# EAGLE design human_interface_arduino (EAGLE 5.11)
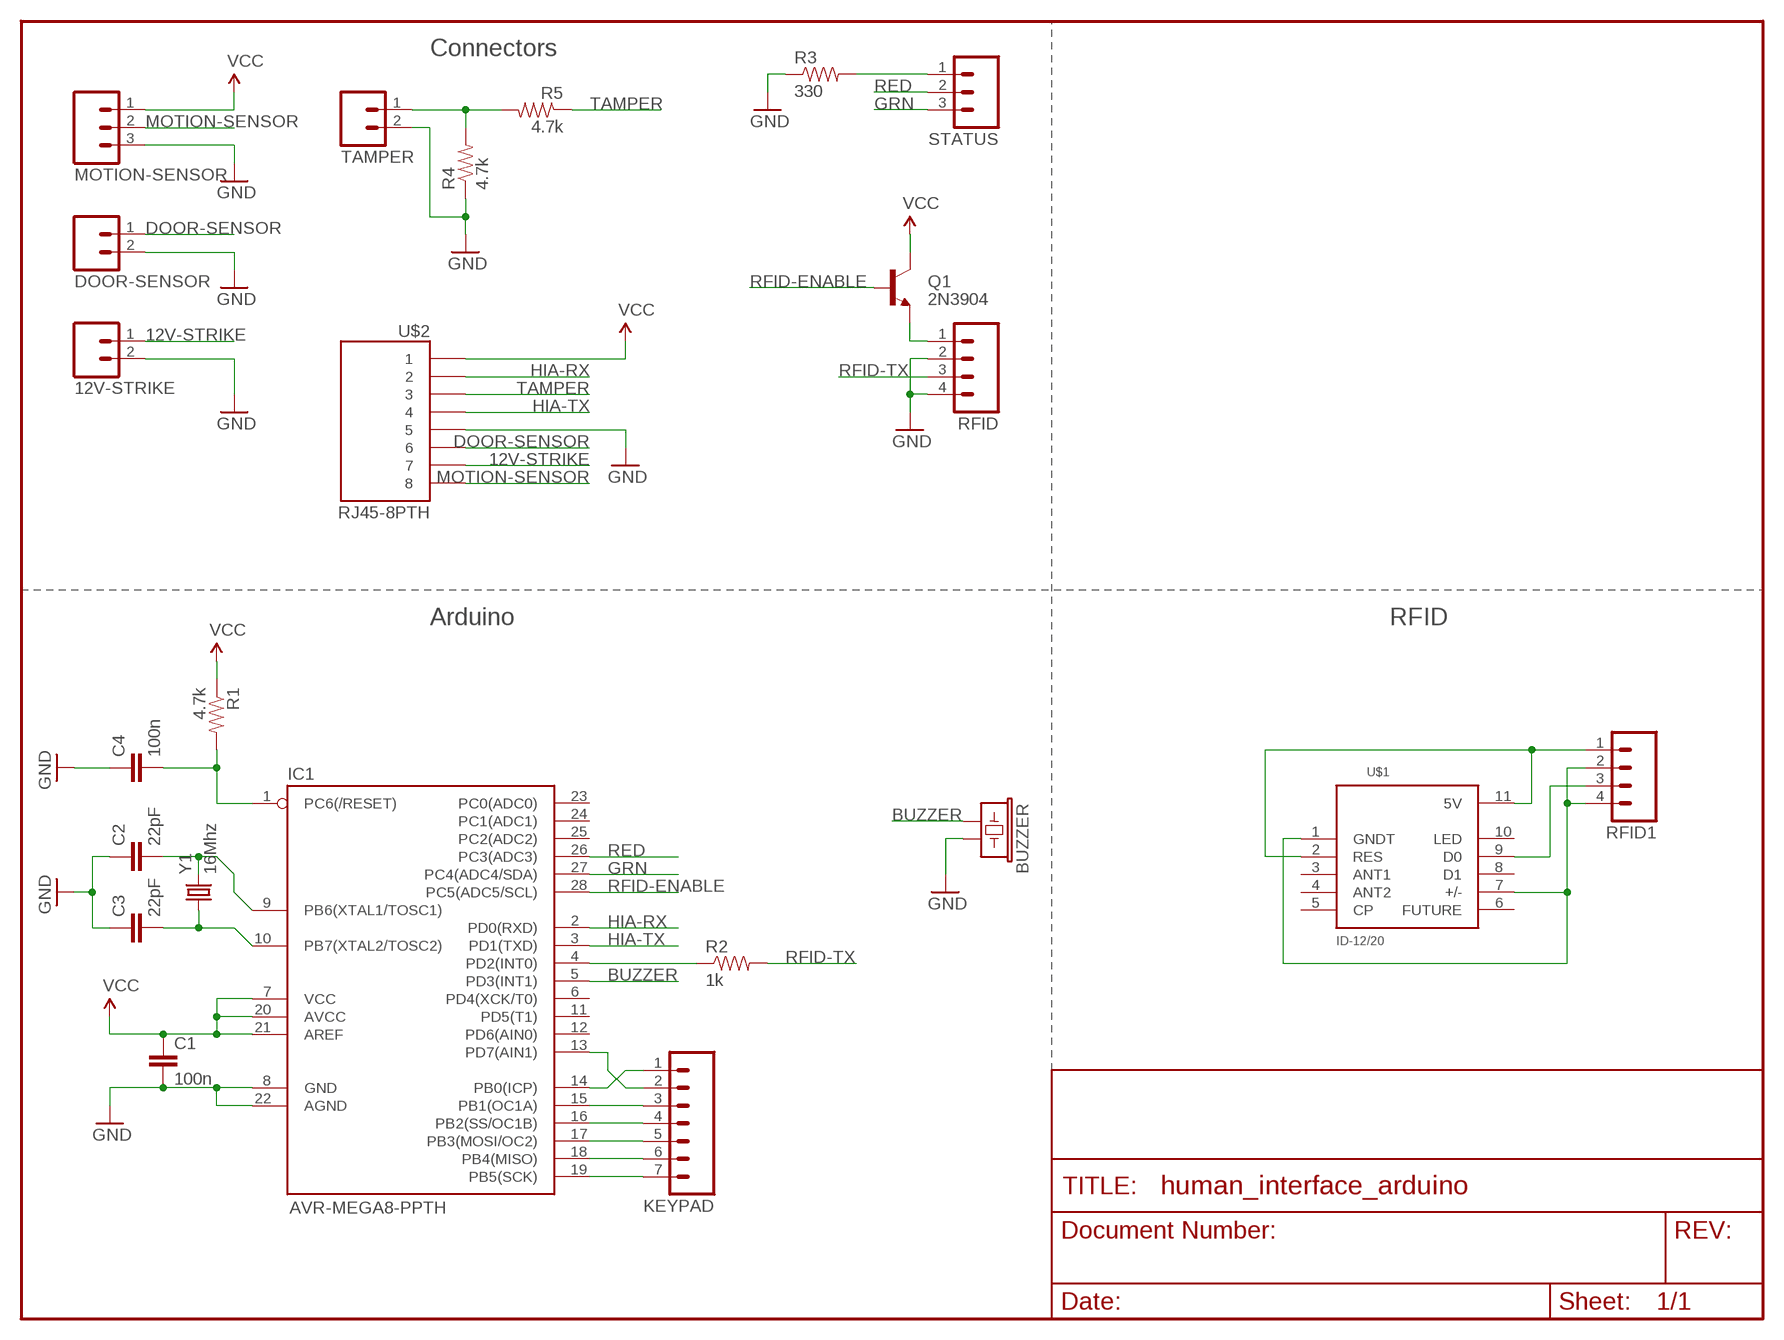
[diagram p0: schematic, sheet 1]

## Parts
12V-STRIKE  M023.5MM  [SCREWTERMINAL-3.5MM-2]
BUZZER  BUZZERPTH  [BUZZER-12MM]
C1  100n  CAPPTH  [CAP-PTH-SMALL]
C2  22pF  CAPPTH  [CAP-PTH-SMALL]
C3  22pF  CAPPTH  [CAP-PTH-SMALL]
C4  100n  CAPPTH  [CAP-PTH-SMALL]
DOOR-SENSOR  M023.5MM  [SCREWTERMINAL-3.5MM-2]
IC1  AVR-MEGA8-PPTH  [DIL28-3]
KEYPAD  M07  [1X07]
MOTION-SENSOR  M03SCREW  [SCREWTERMINAL-3.5MM-3]
Q1  2N3904  TRANSISTOR_NPNTO-92-AMMO  [TO-92-AMMO]
R1  4.7k  RESISTORPTH-1/4W  [AXIAL-0.4]
R2  1k  RESISTORPTH-1/4W  [AXIAL-0.4]
R3  330  RESISTORPTH-1/4W  [AXIAL-0.4]
R4  4.7k  RESISTORPTH-1/4W  [AXIAL-0.4]
R5  4.7k  RESISTORPTH-1/4W  [AXIAL-0.4]
RFID  M04PTH  [1X04]
RFID1  M04PTH  [1X04]
STATUS  M03PTH  [1X03]
TAMPER  M02PTH  [1X02]
U$1  ID-12/20  [ID-12]
U$2  RJ45-8PTH  [RJ45-8]
Y1  16Mhz  CRYSTALHC49US  [HC49US]

## Nets
12V-STRIKE: 12V-STRIKE.1 U$2.7
BUZZER: BUZZER.+ IC1.5(PD3(INT1))
DOOR-SENSOR: DOOR-SENSOR.1 U$2.6
GND: 12V-STRIKE.2 BUZZER.- C1.2 C2.1 C3.1 C4.1 DOOR-SENSOR.2 IC1.8(GND) IC1.22(AGND) MOTION-SENSOR.3 R3.P$1 R4.P$1 RFID.2 RFID.4 TAMPER.2 U$2.5
GRN: IC1.27(PC4(ADC4/SDA)) STATUS.3
HIA-RX: IC1.2(PD0(RXD)) U$2.2
HIA-TX: IC1.3(PD1(TXD)) U$2.4
MOTION-SENSOR: MOTION-SENSOR.2 U$2.8
N$1: C3.2 IC1.10(PB7(XTAL2/TOSC2)) Y1.1
N$2: C2.2 IC1.9(PB6(XTAL1/TOSC1)) Y1.2
N$4: R4.P$2 R5.P$2 TAMPER.1
N$5: IC1.14(PB0(ICP)) KEYPAD.1
N$6: Q1.1(E) RFID.1
N$8: IC1.13(PD7(AIN1)) KEYPAD.2
N$9: RFID1.3 U$1.9(D0)
N$10: IC1.4(PD2(INT0)) R2.P$1
N$12: IC1.15(PB1(OC1A)) KEYPAD.3
N$13: IC1.16(PB2(SS/OC1B)) KEYPAD.4
N$14: IC1.17(PB3(MOSI/OC2)) KEYPAD.5
N$15: R3.P$2 STATUS.1
N$17: IC1.18(PB4(MISO)) KEYPAD.6
N$18: IC1.19(PB5(SCK)) KEYPAD.7
RED: IC1.26(PC3(ADC3)) STATUS.2
RESET: C4.2 IC1.1(PC6(/RESET)) R1.P$2
RFID-ENABLE: IC1.28(PC5(ADC5/SCL)) Q1.2(B)
RFID-GND: RFID1.2 RFID1.4 U$1.1(GNDT) U$1.7(+/-)
RFID-TX: R2.P$2 RFID.3
RFID-VCC: RFID1.1 U$1.2(RES) U$1.11(5V)
TAMPER: R5.P$1 U$2.3
VCC: C1.1 IC1.7(VCC) IC1.20(AVCC) IC1.21(AREF) MOTION-SENSOR.1 Q1.3(C) R1.P$1 U$2.1
Unconnected: IC1.6(PD4(XCK/T0)) IC1.11(PD5(T1)) IC1.12(PD6(AIN0)) IC1.23(PC0(ADC0)) IC1.24(PC1(ADC1)) IC1.25(PC2(ADC2)) U$1.3(ANT1) U$1.4(ANT2) U$1.5(CP) U$1.6(FUTURE) U$1.8(D1) U$1.10(LED)

## Notes on the sheet
- Connectors
- Arduino | RFID

## Library data of the parts
12V-STRIKE DOOR-SENSOR TAMPER = SparkFun:M02: Header 2 Standard 2-pin 0.1" header. Use with straight break away headers (SKU : PRT-00116), right angle break away headers (PRT-00553), swiss pins (PRT-00743), machine pins (PRT-00117), and female headers (PRT-00115). Molex polarized connector foot print use with SKU : PRT-08233 with associated crimp pins and housings.
BUZZER = SparkFun:BUZZER: Buzzer 12mm Spark Fun Electronics SKU : Comp-Buzzer
C1-C4 = SparkFun:CAP: Capacitor Standard 0603 ceramic capacitor, and 0.1" leaded capacitor.
IC1 = SparkFun:AVR-MEGA8-P: MICROCONTROLLER 8 Kbytes FLASH 1 kbytes SRAM 512 bytes EEPROM USART 4-channel 10 bit ADC 2-channel 8 bit ADC
KEYPAD = SparkFun:M07: Header 7 Standard 7-pin 0.1" header. Use with straight break away headers (SKU : PRT-00116), right angle break away headers (PRT-00553), swiss pins (PRT-00743), machine pins (PRT-00117), and female headers (PRT-00115). NOTES ON THE VARIANTS LOCK and LOCK_LONGPADS... This footprint was designed to help hold the alignment of a through-hole component (i.e. 7-pin header) while soldering it into place. You may notice that each hole has been shifted either up or down by 0.005 of an inch from it's more standard position (which is usually a perfectly straight line). This slight alteration caused the pins (the squares in the middle) to touch the edges of the holes. Because they are alternating, it causes a "brace" to hold the header in place. 0.005 has proven to be the perfect amount of "off-center" position when using our standard breakaway headers. Although looks a little odd when you look at the bare footprint, once you have a header in there, the alteration is very hard to notice. Also, if you push a header all the way into place, it is covered up entirely on the bottom side. This idea of altering the position of holes to aid alignment will be further integrated into the Sparkfun Library for other footprints. It can help hold any component with 3 or more connection pins.
MOTION-SENSOR STATUS = SparkFun:M03: Header 3 Standard 3-pin 0.1" header. Use with straight break away headers (SKU : PRT-00116), right angle break away headers (PRT-00553), swiss pins (PRT-00743), machine pins (PRT-00117), and female headers (PRT-00115). Molex polarized connector foot print use with SKU : PRT-08232 with associated crimp pins and housings.
Q1 = SparkFun:TRANSISTOR_NPN: Transistor NPN BJT configuration in SOT23 package. MMBT2222 is the common NPN we use. Double check BCE configuration again layout.
R1-R5 = SparkFun:RESISTOR: Resistor Basic schematic elements and footprints for 0603, 1206, and PTH resistors.
RFID RFID1 = SparkFun:M04: Header 4 Standard 4-pin 0.1" header. Use with straight break away headers (SKU : PRT-00116), right angle break away headers (PRT-00553), swiss pins (PRT-00743), machine pins (PRT-00117), and female headers (PRT-00115). Molex polarized connector foot print use with SKU : PRT-08231 with associated crimp pins and housings. 1MM SMD Version SKU: PRT-10208
U$1 = SparkFun:ID-12/20: ID2, ID12, and ID20 Package
U$2 = SparkFun:RJ45-8: RJ45 Jack Simple RJ45, 8-pin connection - connector for common Cat5, Cat5e, and Cat6 Ethernet cables. Footprint not yet proven in production. Connector sku is PRT-00643; Breakout PCB sku is BOB-00716.
Y1 = SparkFun:CRYSTAL: Crystals Various standard crystals. Proven footprints. Spark Fun Electronics SKU : COM-00534

## Board
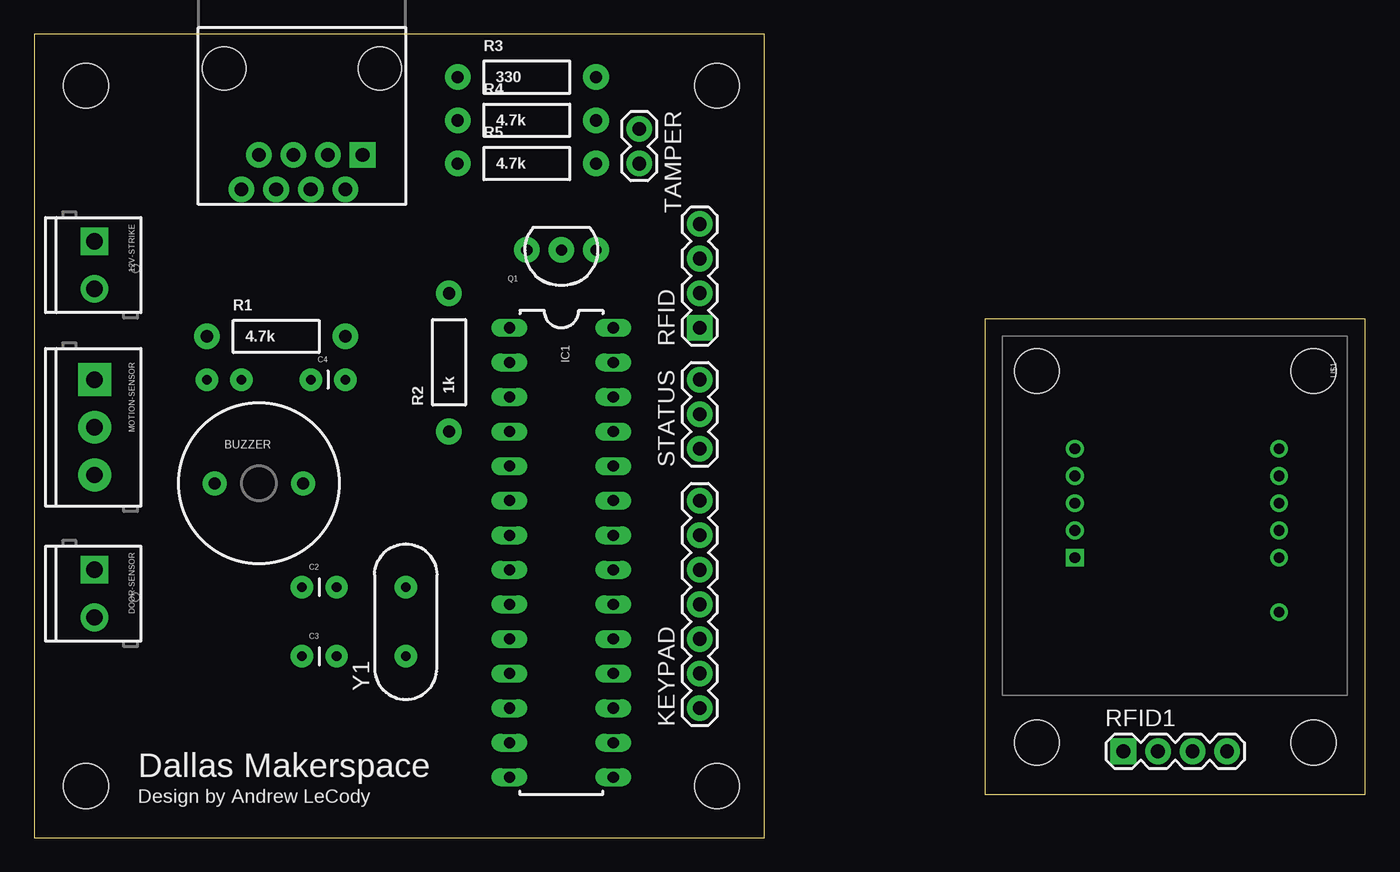
[diagram p1: board, top side]
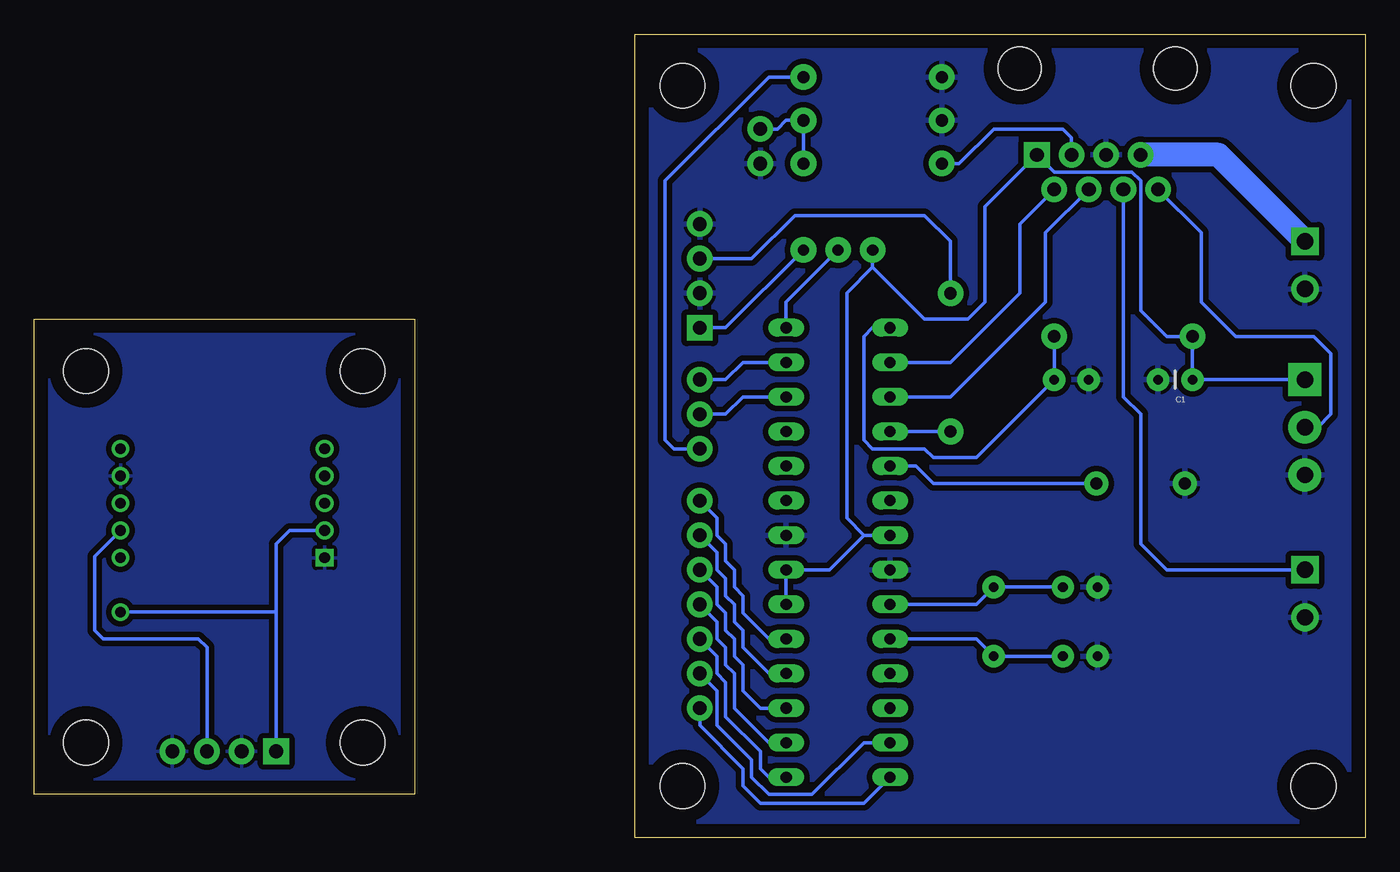
[diagram p2: board, bottom side, seen from below]

Size 97.79 x 59.05 mm. Coordinates in mm from the lower left corner, seen from the top.
Outline: 0,0 53.65,0 53.65,59.05 0,59.05 0,0
Outline: 69.85,3.17 97.79,3.17 97.79,38.1 69.85,38.1 69.85,3.17
Copper layers (1*16): Top 0.035mm / dielectric 1.5mm / Bottom 0.035mm
Design rules "default": minimum track width 10mil, minimum drill 24mil, track to track 8mil, track to pad 8mil, pad to pad 8mil, via to via 8mil, smd to smd 8mil, copper to edge 40mil, drill to drill 8mil, minimum pad ring 10mil, minimum via ring 8mil, stop-mask expansion 4mil, vias tented up to drill 0mil, thermal gap 10mil

### Footprints (pad centres in the part's own frame; a part is rotated, then mirrored left to right if it is on the bottom)
SCREWTERMINAL-3.5MM-2 = drill 1.2 pad 2.032 square: 1 0,0 | drill 1.2 pad 2.032 round: 2 3.5,0
BUZZER-12MM = drill 0.9 pad 1.778 round: + 3.25,0; - -3.25,0
CAP-PTH-SMALL = drill 0.7 pad 1.651 round: 1 0,0; 2 2.54,0
DIL28-3 = drill 0.813 long: 1 -16.51,-3.81; 2 -13.97,-3.81; 3 -11.43,-3.81; 4 -8.89,-3.81; 5 -6.35,-3.81; 6 -3.81,-3.81; 7 -1.27,-3.81; 8 1.27,-3.81; 9 3.81,-3.81; 10 6.35,-3.81; 11 8.89,-3.81; 12 11.43,-3.81; 13 13.97,-3.81; 14 16.51,-3.81; 15 16.51,3.81; 16 13.97,3.81; 17 11.43,3.81; 18 8.89,3.81; 19 6.35,3.81; 20 3.81,3.81; 21 1.27,3.81; 22 -1.27,3.81; 23 -3.81,3.81; 24 -6.35,3.81; 25 -8.89,3.81; 26 -11.43,3.81; 27 -13.97,3.81; 28 -16.51,3.81
1X07 = drill 1.016 pad 1.88 round: 1 0,0; 2 2.54,0; 3 5.08,0; 4 7.62,0; 5 10.16,0; 6 12.7,0; 7 15.24,0
SCREWTERMINAL-3.5MM-3 = drill 1.2 pad 2.413 square: 1 0,0 | drill 1.2 pad 2.413 round: 2 3.5,0; 3 7,0
TO-92-AMMO = drill 0.813 pad 1.88 round: 1 -2.54,0; 2 0,0; 3 2.54,0
AXIAL-0.4 = drill 0.9 pad 1.88 round: P$1 -5.08,0; P$2 5.08,0
1X04 = drill 1.016 pad 1.88 square: 1 0,0 | drill 1.016 pad 1.88 round: 2 2.54,0; 3 5.08,0; 4 7.62,0
1X03 = drill 1.016 pad 1.88 round: 1 0,0; 2 2.54,0; 3 5.08,0
1X02 = drill 1.016 pad 1.88 round: 1 0,0; 2 2.54,0
ID-12 = drill 0.8 square: 1 16.255,5.32 | drill 0.8 round: 2 14.255,5.32; 3 12.255,5.32; 4 10.255,5.32; 5 8.255,5.32; 6 8.255,20.32; 7 10.255,20.32; 8 12.255,20.32; 9 14.255,20.32; 10 16.255,20.32; 11 20.255,20.32
RJ45-8 = drill 1 pad 1.88 square: 1 -4.445,6.35 | drill 1 pad 1.88 round: 2 -3.175,8.89; 3 -1.905,6.35; 4 -0.635,8.89; 5 0.635,6.35; 6 1.905,8.89; 7 3.175,6.35; 8 4.445,8.89 | hole 3.2: -5.715,0; 5.715,0
STAND-OFF = hole 3.302: 0,0
HC49US = drill 0.7 pad 1.651 round: 1 -2.54,0; 2 2.54,0

### Placement (x,y rotation side)
12V-STRIKE  4.45,43.81 270 top
BUZZER  16.51,26.04 0 top
C1  12.7,33.66 180 bottom
C2  19.68,18.41 0 top
C3  19.68,13.34 0 top
C4  20.32,33.66 0 top
DOOR-SENSOR  4.45,19.68 270 top
IC1  38.73,20.95 270 top
KEYPAD  48.9,9.53 90 top
MOTION-SENSOR  4.45,33.66 270 top
Q1  38.73,43.18 180 top
R1  17.78,36.83 0 top
R2  30.48,34.92 90 top
R3  36.2,55.88 0 top
R4  36.2,52.7 0 top
R5  36.2,49.53 0 top
RFID  48.9,37.47 90 top
RFID1  80.01,6.35 0 top
STATUS  48.9,28.57 90 top
TAMPER  44.45,52.07 270 top
U$1  71.12,36.83 270 top
U$2  19.68,56.52 180 top
U$3  [STAND-OFF]  3.81,3.81 0 top
U$4  [STAND-OFF]  50.16,3.81 0 top
U$5  [STAND-OFF]  50.16,55.24 0 top
U$6  [STAND-OFF]  3.81,55.24 0 top
U$7  [STAND-OFF]  73.66,6.99 0 top
U$8  [STAND-OFF]  93.98,6.99 0 top
U$9  [STAND-OFF]  73.66,34.29 0 top
U$10  [STAND-OFF]  93.98,34.29 0 top
Y1  27.3,15.88 90 top

### Tracks (layer width: path | path; a pad name or v marks a point on that pad's centre or on a via)
12V-STRIKE
  Bottom 1.778: 12V-STRIKE.1 10.79,50.16 U$2.7
BUZZER
  Bottom 0.254: IC1.5 33.02,27.3 31.75,26.04 BUZZER.+
DOOR-SENSOR
  Bottom 0.254: U$2.6 17.78,32.38 16.51,31.11 16.51,21.59 14.61,19.68 DOOR-SENSOR.1
GND
  pour Bottom (isolate 0.406): 0,0 0,59.05 53.98,59.05 53.98,0
GRN
  Bottom 0.254: STATUS.3 46.99,33.66 45.72,34.92 IC1.27
HIA-RX
  Bottom 0.254: IC1.2 30.48,34.92 25.4,40.01 25.4,45.09 U$2.2
HIA-TX
  Bottom 0.254: U$2.4 23.5,44.45 23.5,39.37 30.48,32.38 IC1.3
MOTION-SENSOR
  Bottom 0.254: U$2.8 12.06,44.45 12.06,39.37 9.53,36.83 3.81,36.83 2.54,35.56 2.54,31.11 3.5,30.16 MOTION-SENSOR.2
N$1
  Bottom 0.254: IC1.10 28.57,14.61 Y1.1 C3.2
N$2
  Bottom 0.254: IC1.9 28.57,17.14 Y1.2 C2.2
N$4
  Bottom 0.254: R5.P$2 R4.P$2 42.55,52.7 43.18,52.07 TAMPER.1
N$5
  Bottom 0.254: KEYPAD.1 48.9,8.26 45.72,5.08 45.72,3.81 44.45,2.54 36.83,2.54 IC1.14
N$6
  Bottom 0.254: RFID.1 46.99,37.47 Q1.1
N$8
  Bottom 0.254: IC1.13 36.83,6.99 40.64,3.17 43.81,3.17 45.09,4.45 45.09,5.71 47.62,8.26 47.62,10.79 KEYPAD.2
N$9
  Bottom 0.254: RFID1.3 85.09,13.97 85.72,14.61 92.71,14.61 93.34,15.24 93.34,20.67 U$1.9
N$10
  Bottom 0.254: R2.P$1 IC1.4
N$12
  Bottom 0.254: IC1.15 43.81,4.45 44.45,5.08 44.45,6.35 46.99,8.89 46.99,11.43 47.62,12.06 47.62,13.34 KEYPAD.3
N$13
  Bottom 0.254: IC1.16 43.81,6.99 46.35,9.53 46.35,12.06 46.99,12.7 46.99,13.97 47.62,14.61 47.62,15.88 KEYPAD.4
N$14
  Bottom 0.254: IC1.17 44.45,9.53 45.72,10.79 45.72,12.7 46.35,13.34 46.35,14.61 46.99,15.24 46.99,16.51 47.62,17.14 47.62,18.41 KEYPAD.5
N$15
  Bottom 0.254: STATUS.1 50.8,28.57 51.44,29.21 51.44,48.26 43.81,55.88 R3.P$2
N$17
  Bottom 0.254: IC1.18 43.81,12.06 45.72,13.97 45.72,15.24 46.35,15.88 46.35,17.14 46.99,17.78 46.99,19.05 47.62,19.68 47.62,20.95 KEYPAD.6
N$18
  Bottom 0.254: IC1.19 43.81,14.61 45.72,16.51 45.72,17.78 46.35,18.41 46.35,19.68 46.99,20.32 46.99,21.59 47.62,22.23 47.62,23.5 KEYPAD.7
RED
  Bottom 0.254: STATUS.2 46.99,31.11 45.72,32.38 IC1.26
RESET
  Bottom 0.254: IC1.1 36.2,37.47 36.83,36.83 36.83,29.21 36.2,28.57 32.38,28.57 31.75,27.94 28.57,27.94 C4.2 R1.P$2
RFID-ENABLE
  Bottom 0.254: Q1.2 42.55,39.37 IC1.28
RFID-GND
  pour Bottom (isolate 0.406): 69.85,3.17 69.85,38.1 97.79,38.1 97.79,3.17
RFID-TX
  Bottom 0.254: R2.P$2 30.48,43.81 32.38,45.72 41.91,45.72 45.09,42.55 RFID.3
RFID-VCC
  Bottom 0.254: U$1.2 79.03,22.57 80.01,21.59 80.01,16.51 | RFID1.1 80.01,16.51 | U$1.11 80.08,16.57 80.01,16.51
TAMPER
  Bottom 0.254: R5.P$1 29.84,49.53 27.3,52.07 22.23,52.07 21.59,51.44 U$2.3
VCC
  Bottom 0.254: 36.2,41.91 32.38,38.1 29.21,38.1 27.94,39.37 27.94,46.35 U$2.1 22.86,48.9 17.14,48.9 16.51,48.26 16.51,38.73 14.61,36.83 R1.P$1 C1.1 MOTION-SENSOR.1 | 36.2,41.91 Q1.3 | 36.83,22.23 IC1.7 | 36.83,22.23 38.1,23.5 38.1,40.01 36.2,41.91 | 36.83,22.23 39.37,19.68 IC1.21 IC1.20

### Text on the board
tPlace: Dallas Makerspace | Design by Andrew LeCody